# Altium schematic sheet Умножитель.SchDoc: Интерфейсный модуль ФЭУ-102
size A3; Address1: (с) Быканов Андрей; Address2: г.Тула 2016г.; Revision: 1.3
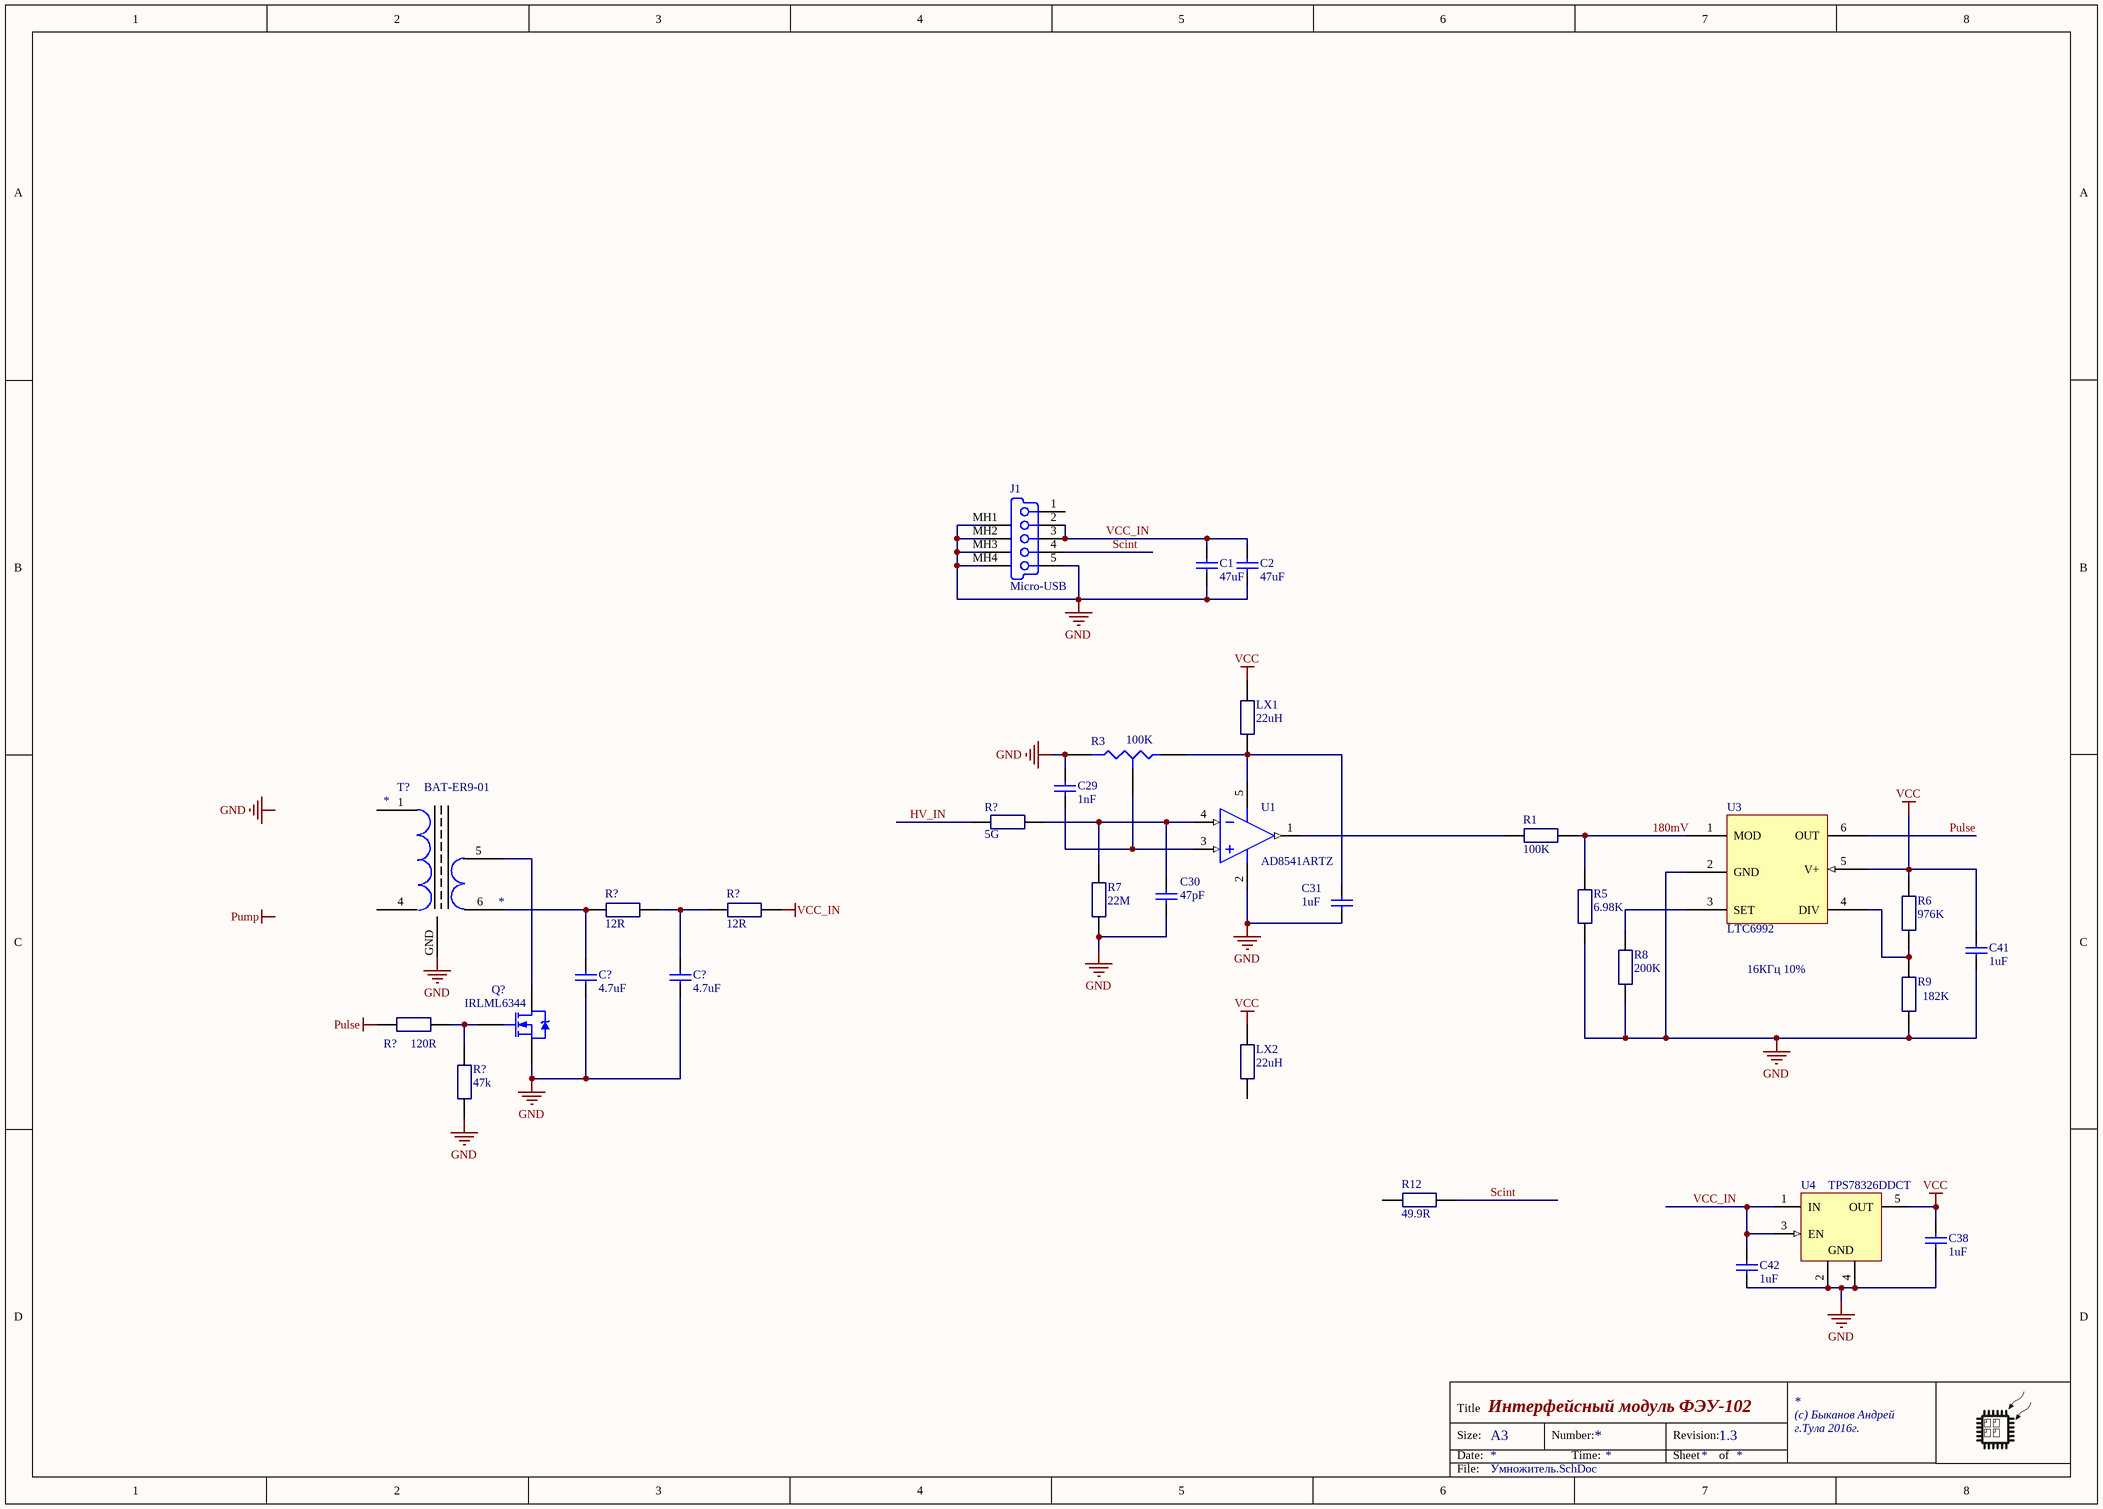
[diagram p0: Умножитель.SchDoc]

## Parts
(Parts that share a designator on the sheet are numbered #1, #2 ... from top to bottom, then left to right.)
C1  47uF  [C1206]
C2  47uF  [C1206]
C29  1nF  [1608[0603]_CAP]
C30  47pF  [1608[0603]_CAP]
C31  1uF  [1608[0603]_CAP]
C38  1uF  [1608[0603]_CAP]
C41  1uF  [1608[0603]_CAP]
C42  1uF  [1608[0603]_CAP]
C?#1  4.7uF  [C1206]
C?#2  4.7uF  [C1206]
J1  Micro-USB  [47346-0001]
LX1  22uH  [Resistor]
LX2  22uH  [Resistor]
Q?  IRLML6344  [SOT-23_N]
R1  100K  [1608[0603]]
R3  100K  [3223W]
R5  6.98K  [1608[0603]]
R6  976K  [1608[0603]]
R7  22M  [1608[0603]]
R8  200K  [1608[0603]]
R9  182K  [1608[0603]]
R12  49.9R  [1608[0603]]
R?#1  5G  [HVF2512T5007FE]
R?#2  12R  [1608[0603]_RES]
R?#3  12R  [1608[0603]_RES]
R?#4  120R  [1608[0603]_RES]
R?#5  47k  [1608[0603]_RES]
T?  BAT-ER9-01  [Epcos ER9.5/5]
U1  AD8541ARTZ  [ADI-RJ-5_N]
U3  LTC6992  [SOT23-6L]
U4  TPS78326DDCT  [TI-DDC5_N]

## Nets
GND: C1.2 C2.2 C29.1 C30.2 C31.2 C38.1 C41.2 C42.2 C?#1.2 C?#2.2 J1.5(GND) J1.MH1(Tab) J1.MH2(Tab) J1.MH3(Tab) J1.MH4(Tab) Q?.2(S) R3.2(B) R5.2 R7.2 R8.2 R9.2 R?#5.1(A) T?.GND U1.2(-V) U3.2(GND) U4.2(GND) U4.4(GND)
Pulse: R?#4.2 U3.6(OUT)
VCC: C38.2 C41.1 LX1.1(A) LX2.1(A) R6.1(A) U3.5(V+) U4.5(OUT)
VCC_IN: C1.1 C2.1 C42.1 J1.2(D-) J1.3(D+) R?#3.2 U4.1(IN) U4.3(EN)
180mV: R1.1(A) R5.1(A) U3.1(MOD)
HV_IN: R?#1.1(A)
Scint: J1.4(NC) R12.1(A)
NetC29_2: C29.2 R3.3(TAP) U1.3(+IN_A)
NetC30_1: C30.1 R7.1(A) R?#1.2 U1.4(-IN_A)
NetC31_1: C31.1 LX1.2 R3.1(A) U1.5(+V)
NetC?#1_1: C?#1.1 R?#2.1(A) T?.6
NetC?#2_1: C?#2.1 R?#2.2 R?#3.1(A)
NetQ?_1: Q?.1(G) R?#4.1(A) R?#5.2
NetQ?_3: Q?.3(D) T?.5
NetR1_2: R1.2 U1.1(OUT_A)
NetR6_2: R6.2 R9.1(A) U3.4(DIV)
NetR8_1: R8.1(A) U3.3(SET)

Not connected (* = marked no-connect by the designer): J1 1(V_BUS_(5V)); LX2 2; R12 2; T? 1 4

## Notes on the sheet
- 16КГц 10%
- Labels drawn without touching a wire or pin: GND, Pump
- Title
- Size:
- Date:
- A3
- Number:
- Time:
- Revision:
- Sheet
- of
- File:

## Library data of the parts
C1 C2 = Cap Semi: Capacitor (Semiconductor SIM Model); Order: GRM31CR60J476ME19L; Published: 8-Jun-2000; LatestRevisionDate: 29-May-2009; LatestRevisionNote: IPC-7351 Footprint Added.; PackageReference: C0402; Publisher: Altium Limited; PackageDescription: Chip Capacitor; Value: 47uF
C29 = Cap Semi: Capacitor (Semiconductor SIM Model); Order: CC0603JRNPO9BN102; Published: 8-Jun-2000; LatestRevisionDate: 29-May-2009; LatestRevisionNote: IPC-7351 Footprint Added.; PackageReference: C0402; Publisher: Altium Limited; PackageDescription: Chip Capacitor; Value: 1nF
C30 = Cap Semi: Capacitor (Semiconductor SIM Model); Order: CC0603JRNPOABN470; Published: 8-Jun-2000; LatestRevisionDate: 29-May-2009; LatestRevisionNote: IPC-7351 Footprint Added.; PackageReference: C0402; Publisher: Altium Limited; PackageDescription: Chip Capacitor; Value: 47pF
C31 C38 C41 C42 = Cap Semi: Capacitor (Semiconductor SIM Model); Order: CC0603KRX5R7BB105; Published: 8-Jun-2000; LatestRevisionDate: 29-May-2009; LatestRevisionNote: IPC-7351 Footprint Added.; Publisher: Altium Limited; PackageDescription: Chip Capacitor; Value: 1uF
  C31: PackageReference: C1206
  C38 C41 C42: PackageReference: C0402
C?#1 C?#2 = Cap Semi: Capacitor (Semiconductor SIM Model); Order: CC1206KKX7R8BB475; Published: 8-Jun-2000; LatestRevisionDate: 29-May-2009; LatestRevisionNote: IPC-7351 Footprint Added.; PackageReference: C1206; Publisher: Altium Limited; PackageDescription: Chip Capacitor; Value: 4.7uF
J1 = 0481900001: USB On-The-Go (OTG) Mini-B Receptacle, Right Angle, SMT, 0.80mm (.031") Pitch, Solder Tabs with Back Cover, Recessed Type; Order: Molex 47346-0001
LX1 LX2 = Resistor 0805: Order: LQM21FN220N00L; Value: 22uH
Q? = IRLML2402: HEXFET Power MOSFET; Published: 8-Jun-2000; LatestRevisionDate: 20-Nov-2009; LatestRevisionNote: IPC-7351 Footprint Added.; DatasheetVersion: Aug-1997; PackageReference: SOT-23; Publisher: Altium Limited; PackageDescription: 3-Pin SOT-23 Package 0.95 mm Pitch, 2.3 mm Lead Span; ComponentLink1Description: Manufacturer Link; ComponentLink1URL: http://www.irf.com/; ComponentLink2Description: Datasheet; ComponentLink2URL: http://www.irf.com/product-info/datasheets/data/irlml2402.pdf; Order: IRLML6344
R1 = Resistor 0805: Order: RC0603FR-10100KL; Value: 100K
R3 = Res Tap: Tapped Resistor; Sim Note: Enter the Resistance value and the set point into parameter fields.; Set Position: 0.5; Order: 3223W-1-104E; Published: 24-Mar-1999; LatestRevisionDate: 17-Jul-2002; LatestRevisionNote: Re-released for DXP Platform.; PackageReference: VR3; Publisher: Altium Limited; PackageDescription: Variable Resistor, Thru-Hole; 3 Leads; Value: 100K
R5 = Resistor 0805: Order: RC0603FR-076K98L; Value: 6.98K
R6 = Resistor 0805: Order: RC0603FR-07976KL; Value: 976K
R7 = Resistor 0805: Order: ERJ-3GEYK226V; Value: 22M
R8 = Resistor 0805: Order: RC0603FR-07200KL; Value: 200K
R9 = Resistor 0805: Order: RC0805FR-07182KL; Value: 182K
R12 = Resistor 0805: Order: RC0603FR-0749R9L; Value: 49.9R
R?#1 = Resistor 0805: Order: HVF2512T5007FE; Value: 5G
R?#2 R?#3 = Resistor 0805: Order: ERJ3GEYJ120V; Avail: 20; Value: 12R
R?#4 = Resistor 0805: Order: RC0603FR-07120RL; Value: 120R
R?#5 = Resistor 0805: Order: RC0603FR-0747KL; Avail: 20; Value: 47k
T? = Epcos ER9.5/5: Order: BAT-ER9-01
U1 = AD8541ARTZ-R2: Single Channel RRIO Operational Amplifier, 1 MHz BW, 920 mV/us SR, Industrial, 5-pin SOT23 (RJ-5), Reel; Generic Part Number: AD8541; Manufacturer: Analog Devices; Amplifiers Per Package: 1; Input Bias Current: 4pA; Input Offset Voltage: 1mV; Iq/Amp: 65uA; Small Signal Bandwidth: 1MHz; V Span Max: 5.5V; V Span Min: 2.7V; DatasheetVersion: Rev. G; PackageVersion: 121608-A; PackageReference: RJ-5; PackageDescription: 5-Pin Small Outline Transistor Package, Body 2.9 x 1.6 mm, Pitch 0.95 mm; Supplier 1: Digi-Key; Supplier Part Number 1: AD8541ARTZ-R2TR-ND; Supplier 2: Digi-Key; Supplier Part Number 2: AD8541ARTZ-R2CT-ND; Supplier 3: Digi-Key; Supplier Part Number 3: AD8541ARTZ-R2DKR-ND; Supplier 4: Farnell; Supplier Part Number 4: 1837434; Supplier 5: Newark; Supplier Part Number 5: 59K6820; Slew Rate: 920mV/us; Mounting Technology: Surface Mount; Code_JEDEC: MO-178-AA; PartNumber: AD8541ARTZ-R2; ComponentLink1Description: Manufacturer URL; ComponentLink1URL: http://www.analog.com/en/index.html; ComponentLink2Description: Datasheet; ComponentLink2URL: http://www.analog.com/static/imported-files/data_sheets/AD8541_8542_8544.pdf; ComponentLink3Description: Package Specification; ComponentLink3URL: http://www.analog.com/static/imported-files/packages/PKG_PDF/SOT-23(RJ)/RJ_5.pdf; ComponentLink4Description: Reference Circuit; ComponentLink4URL: http://www.analog.com/en/all-operational-amplifiers-op-amps/operational-amplifiers-op-amps/ad8541/products/product.html#product-recommendations; Order: AD8541ARTZ
U4 = TPS78330DDCR: Single Output LDO, 150 mA, Fixed 3 V Output, 2.2 to 5.5 V Input, with Ultra-Low IQ, 5-pin SOT (DDC), -40 to 105 degC, Green (RoHS & no Sb/Br); Manufacturer: Texas Instruments; Accuracy(%): 3; Iout(Max)(A): 0.15; Iq(Typ)(mA): 0.0005; Rating: Catalog; SubFamily: Single Channel LDO; Vdo(Typ)(mV): 130; Vin(Max)(V): 5.5; Vin(Min)(V): 2.2; DatasheetVersion: SBVS133; PackageVersion: 4204403-2/E; PackageReference: DDC5; PackageDescription: 5-Pin Plastic Small Outline, Body 2.9 x 1.6 mm, 0.95 mm Pitch; Supplier 1: Digi-Key; Supplier Part Number 1: 296-25880-2-ND; Supplier 2: Digi-Key; Supplier Part Number 2: 296-25880-1-ND; Supplier 3: Digi-Key; Supplier Part Number 3: 296-25880-6-ND; Supplier 4: Newark; Supplier Part Number 4: 72R6681; Supplier 5: Mouser; Supplier Part Number 5: 595-TPS78330DDCR; Eco-Plan: Green (RoHS & no Sb/Br); Fixed Output Options(V): 3; Vout Adj(Max)(V): 3; Vout Adj(Min)(V): 3; Mounting Technology: Surface Mount; Code_JEDEC: MO-193; PartNumber: TPS78326DDCT; ComponentLink1Description: Manufacturer URL; ComponentLink1URL: http://www.ti.com/; ComponentLink2Description: Datasheet; ComponentLink2URL: http://www.ti.com/general/docs/lit/getliterature.tsp?genericPartNumber=TPS78330&fileType=pdf; ComponentLink3Description: Package Specification; ComponentLink3URL: http://www.ti.com/litv/pdf/mpds123d; Order: TPS78326DDCT